# Altium schematic sheet Pneumatics.SchDoc: Solenoid Drivers
size A4; DocumentNumber: 1; Revision: 1; SheetNumber: 2; SheetTotal: 5
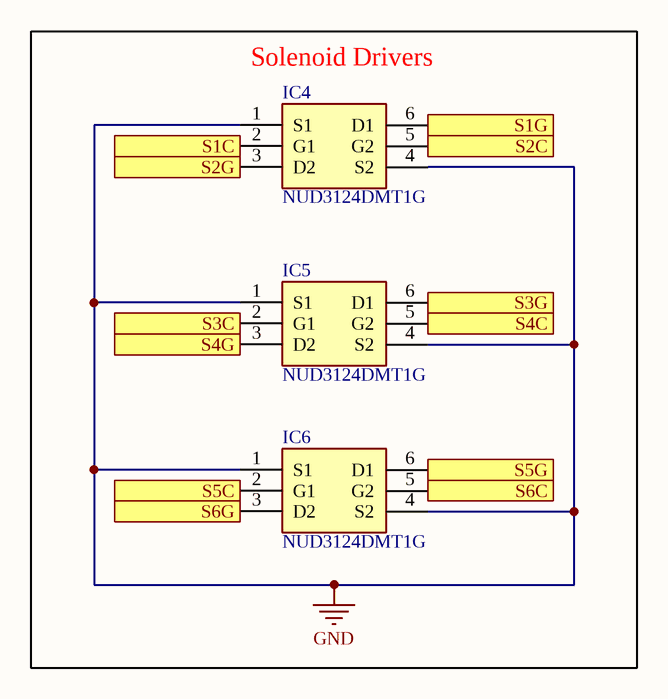
[diagram p0: Pneumatics.SchDoc]

## Parts
IC4  NUD3124DMT1G  [SOT95P275X110-6N]
IC5  NUD3124DMT1G  [SOT95P275X110-6N]
IC6  NUD3124DMT1G  [SOT95P275X110-6N]

## Blocks framed on the sheet
Solenoid Drivers: IC4-IC6

## Ports
S1C (in), S1G (in), S2C (in), S2G (in), S3C (in), S3G (in), S4C (in), S4G (in), S5C (in), S5G (in), S6C (in), S6G (in)

## Nets
GND: IC4.1(S1) IC4.4(S2) IC5.1(S1) IC5.4(S2) IC6.1(S1) IC6.4(S2)
S1C: IC4.2(G1) ; port S1C
S1G: IC4.6(D1) ; port S1G
S2C: IC4.5(G2) ; port S2C
S2G: IC4.3(D2) ; port S2G
S3C: IC5.2(G1) ; port S3C
S3G: IC5.6(D1) ; port S3G
S4C: IC5.5(G2) ; port S4C
S4G: IC5.3(D2) ; port S4G
S5C: IC6.2(G1) ; port S5C
S5G: IC6.6(D1) ; port S5G
S6C: IC6.5(G2) ; port S6C
S6G: IC6.3(D2) ; port S6G

## Notes on the sheet
- Size:
- Date:
- Title
- A4
- Project:
- Time:
- Revision:
- Sheet
- of
- Engineer
- File:

## Library data of the parts
IC4-IC6 = NUD3124DMT1G: Integrated Circuit; Manufacturer_Name: onsemi; Datasheet Link: http://www.onsemi.com/pub/Collateral/NUD3124-D.PDF; Height: 1.1mm; Manufacturer_Part_Number: NUD3124DMT1G; Mouser Part Number: 863-NUD3124DMT1G; Mouser Price/Stock: https://www.mouser.co.uk/ProductDetail/onsemi/NUD3124DMT1G?qs=ZXBb0xZ9WeDtXMbpPTBW4g%3D%3D; Arrow Part Number: NUD3124DMT1G; Arrow Price/Stock: https://www.arrow.com/en/products/nud3124dmt1g/on-semiconductor?region=nac